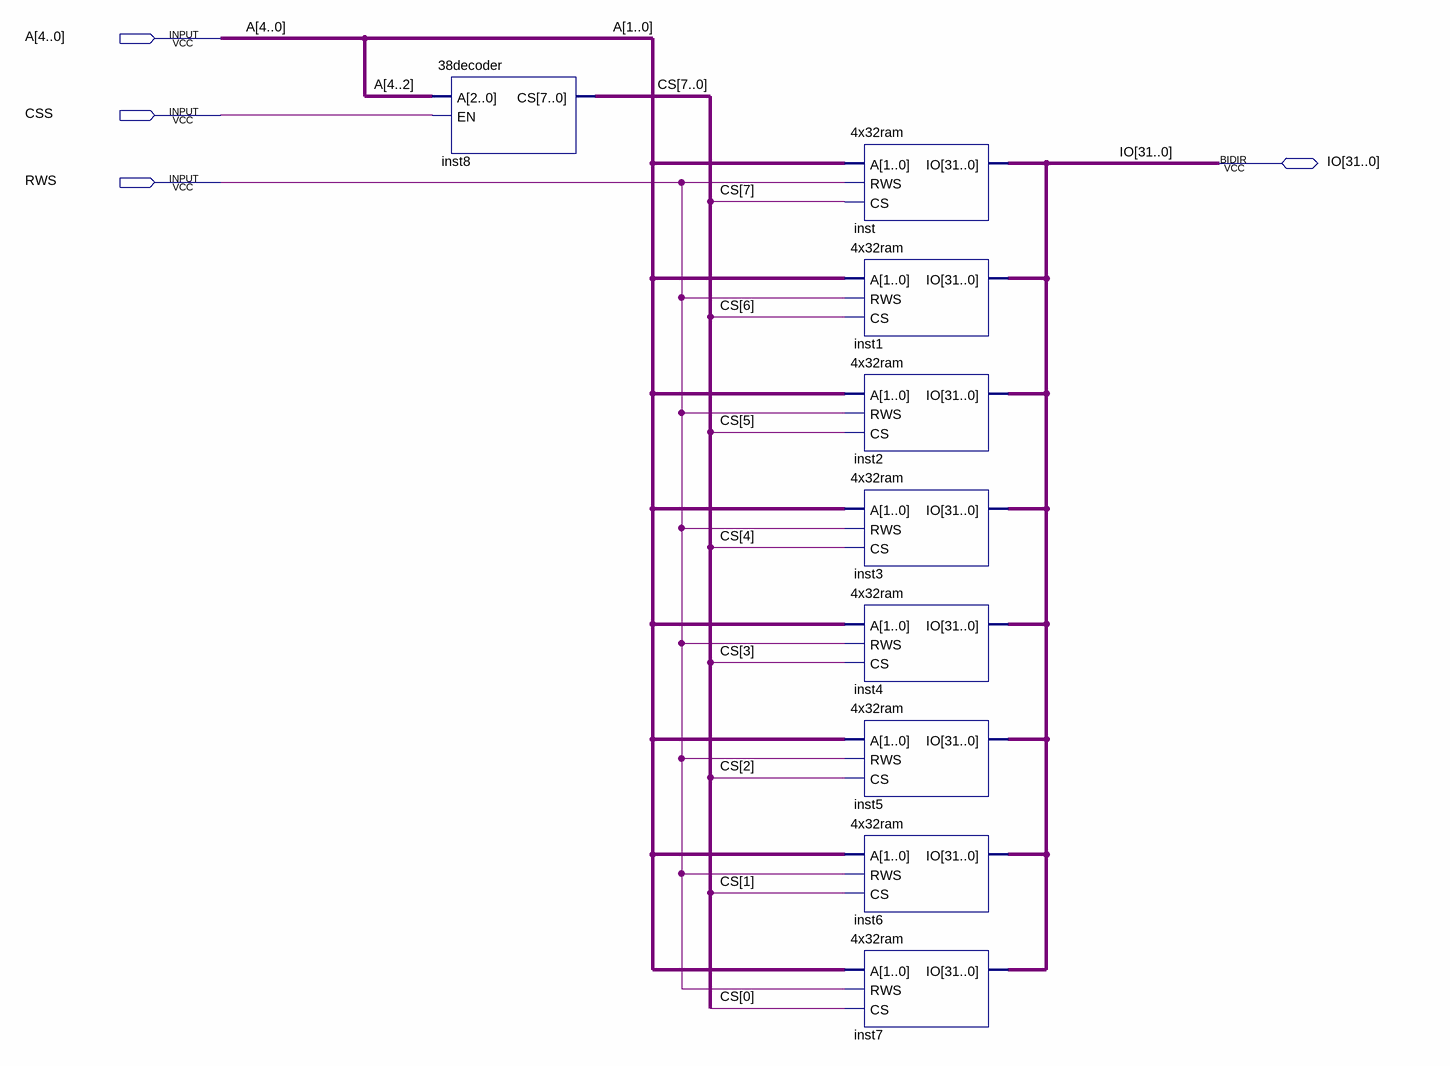
[diagram p0: schematic sheet]
// Quartus schematic 32x32ram.bdf as structural Verilog: 9 symbols, 4 pins
module \32x32ram  (
  input  [4:0] A,
  input  CSS,
  input  RWS,
  inout  [31:0] IO
);

  wire [7:0] CS;

  \38decoder  inst8 (.A(A[4:2]), .EN(CSS), .CS(CS));
  \4x32ram  inst (.A(A[1:0]), .RWS(RWS), .CS(CS[7]), .IO(IO));
  \4x32ram  inst1 (.A(A[1:0]), .RWS(RWS), .CS(CS[6]), .IO(IO));
  \4x32ram  inst2 (.A(A[1:0]), .RWS(RWS), .CS(CS[5]), .IO(IO));
  \4x32ram  inst3 (.A(A[1:0]), .RWS(RWS), .CS(CS[4]), .IO(IO));
  \4x32ram  inst4 (.A(A[1:0]), .RWS(RWS), .CS(CS[3]), .IO(IO));
  \4x32ram  inst5 (.A(A[1:0]), .RWS(RWS), .CS(CS[2]), .IO(IO));
  \4x32ram  inst6 (.A(A[1:0]), .RWS(RWS), .CS(CS[1]), .IO(IO));
  \4x32ram  inst7 (.A(A[1:0]), .RWS(RWS), .CS(CS[0]), .IO(IO));
endmodule
